# Altium schematic sheet Bluetooth.SchDoc
size A4
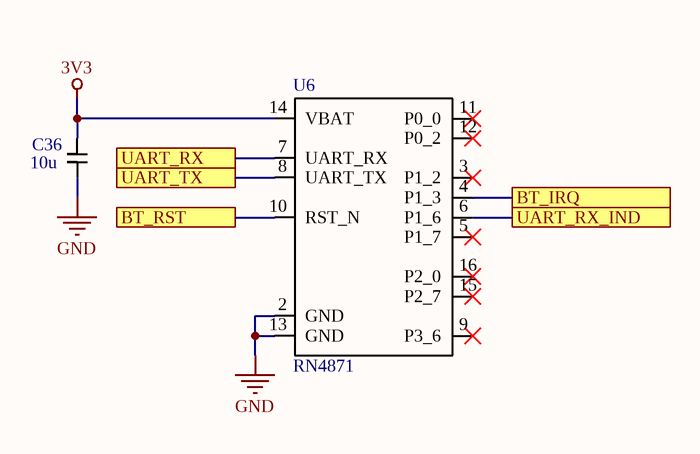
[diagram p0: Bluetooth.SchDoc]

## Parts
C36  10u  [Capacitor_0603]
U6  RN4871  [RN4871]

## Ports
BT_IRQ, BT_RST, UART_RX, UART_RX_IND, UART_TX

## Nets
3V3: C36.2 U6.14(VBAT)
GND: C36.1 U6.2(GND) U6.13(GND)
BT_IRQ: U6.4(P1_3) ; port BT_IRQ
BT_RST: U6.10(RST_N) ; port BT_RST
UART_RX: U6.7(UART_RX) ; port UART_RX
UART_RX_IND: U6.6(P1_6) ; port UART_RX_IND
UART_TX: U6.8(UART_TX) ; port UART_TX

Not connected (* = marked no-connect by the designer): U6 3(P1_2)* 5(P1_7)* 9(P3_6)* 11(P0_0)* 12(P0_2)* 15(P2_7)* 16(P2_0)*

## Library data of the parts
C36 = Capacitor